# Altium schematic sheet Sheet1.SchDoc
size A4
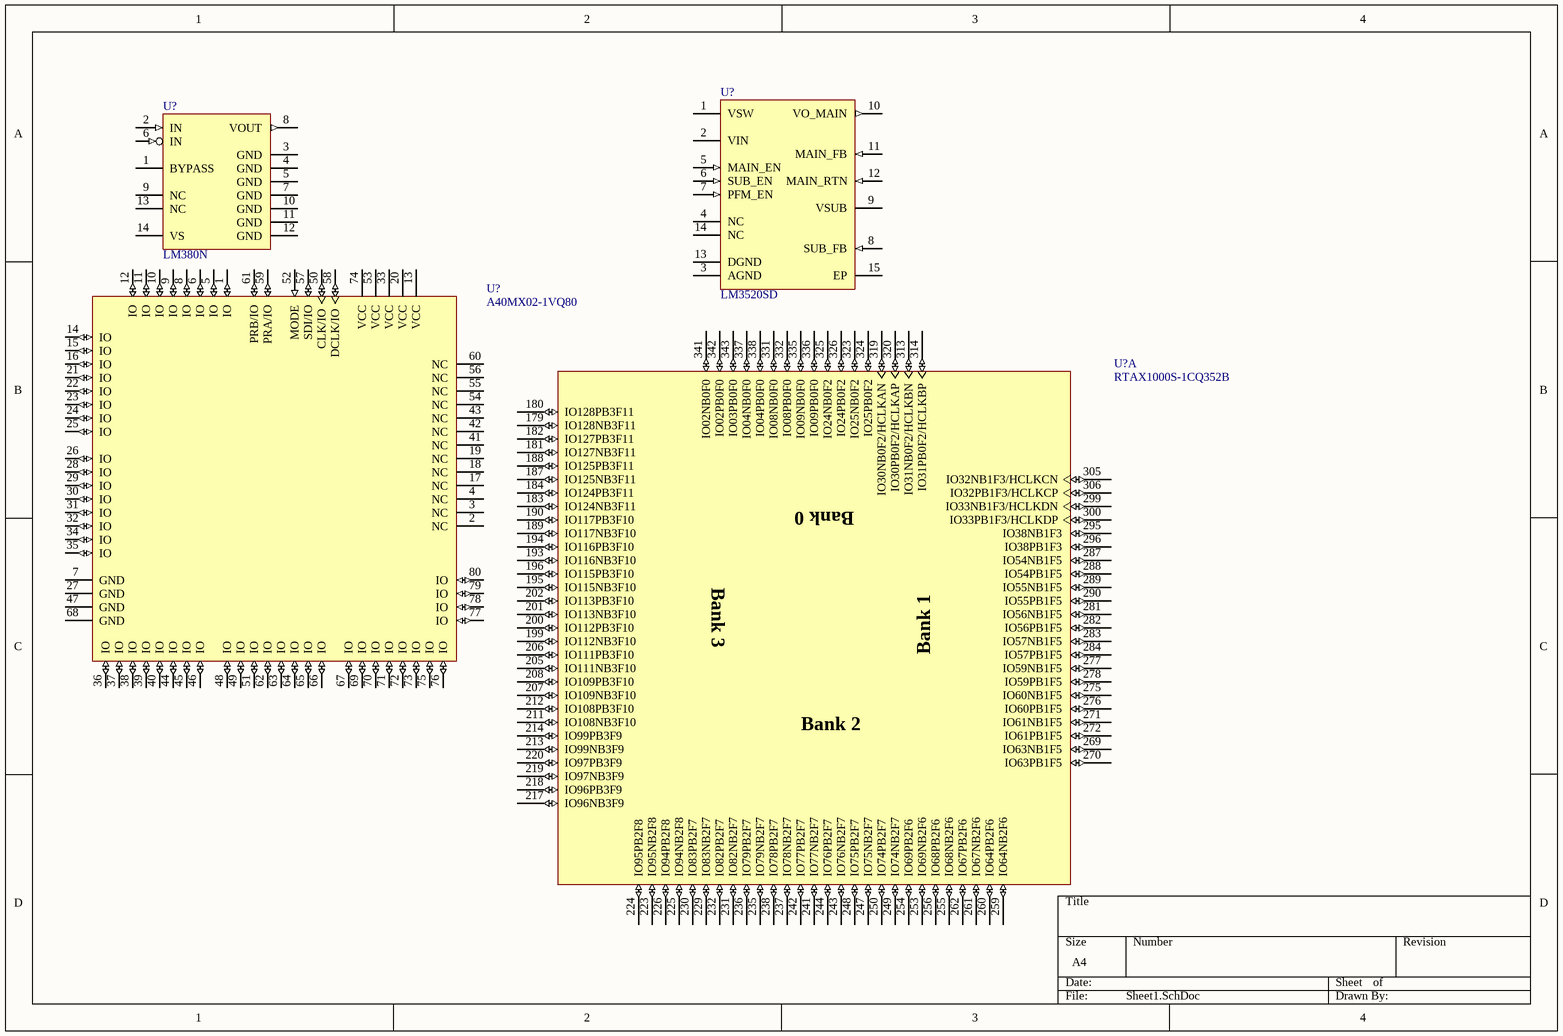
[diagram p0: Sheet1.SchDoc]

## Parts
(Parts that share a designator on the sheet are numbered #1, #2 ... from top to bottom, then left to right.)
U?#1  LM3520SD  [SDA14A]
U?#2  LM380N  [N14A]
U?#3  A40MX02-1VQ80  [VQ80_N]
U?#4  RTAX1000S-1CQ352B  [CQ352_N]  (part A of 5)

## Nets

Not connected (* = marked no-connect by the designer): U?#1 1(VSW) 2(VIN) 3(AGND) 4(NC) 5(MAIN_EN) 6(SUB_EN) 7(PFM_EN) 8(SUB_FB) 9(VSUB) 10(VO_MAIN) 11(MAIN_FB) 12(MAIN_RTN) 13(DGND) 14(NC) 15(EP); U?#2 1(BYPASS) 2(IN) 3(GND) 4(GND) 5(GND) 6(IN) 7(GND) 8(VOUT) 9(NC) 10(GND) 11(GND) 12(GND) 13(NC) 14(VS); U?#3 1(IO) 2(NC) 3(NC) 4(NC) 5(IO) 6(IO) 7(GND) 8(IO) 9(IO) 10(IO) 11(IO) 12(IO) 13(VCC) 14(IO) 15(IO) 16(IO) 17(NC) 18(NC) 19(NC) 20(VCC) 21(IO) 22(IO) 23(IO) 24(IO) 25(IO) 26(IO) 27(GND) 28(IO) 29(IO) 30(IO) 31(IO) 32(IO) 33(VCC) 34(IO) 35(IO) 36(IO) 37(IO) 38(IO) 39(IO) 40(IO) 41(NC) 42(NC) 43(NC) 44(IO) 45(IO) 46(IO) 47(GND) 48(IO) 49(IO) 50(CLK/IO) 51(IO) 52(MODE) 53(VCC) 54(NC) 55(NC) 56(NC) 57(SDI/IO) 58(DCLK/IO) 59(PRA/IO) 60(NC) 61(PRB/IO) 62(IO) 63(IO) 64(IO) 65(IO) 66(IO) 67(IO) 68(GND) 69(IO) 70(IO) 71(IO) 72(IO) 73(IO) 74(VCC) 75(IO) 76(IO) 77(IO) 78(IO) 79(IO) 80(IO); U?#4 179(IO128NB3F11) 180(IO128PB3F11) 181(IO127NB3F11) 182(IO127PB3F11) 183(IO124NB3F11) 184(IO124PB3F11) 187(IO125NB3F11) 188(IO125PB3F11) 189(IO117NB3F10) 190(IO117PB3F10) 193(IO116NB3F10) 194(IO116PB3F10) 195(IO115NB3F10) 196(IO115PB3F10) 199(IO112NB3F10) 200(IO112PB3F10) 201(IO113NB3F10) 202(IO113PB3F10) 205(IO111NB3F10) 206(IO111PB3F10) 207(IO109NB3F10) 208(IO109PB3F10) 211(IO108NB3F10) 212(IO108PB3F10) 213(IO99NB3F9) 214(IO99PB3F9) 217(IO96NB3F9) 218(IO96PB3F9) 219(IO97NB3F9) 220(IO97PB3F9) 223(IO95NB2F8) 224(IO95PB2F8) 225(IO94NB2F8) 226(IO94PB2F8) 229(IO83NB2F7) 230(IO83PB2F7) 231(IO82NB2F7) 232(IO82PB2F7) 235(IO79NB2F7) 236(IO79PB2F7) 237(IO78NB2F7) 238(IO78PB2F7) 241(IO77NB2F7) 242(IO77PB2F7) 243(IO76NB2F7) 244(IO76PB2F7) 247(IO75NB2F7) 248(IO75PB2F7) 249(IO74NB2F7) 250(IO74PB2F7) 253(IO69NB2F6) 254(IO69PB2F6) 255(IO68NB2F6) 256(IO68PB2F6) 259(IO64NB2F6) 260(IO64PB2F6) 261(IO67NB2F6) 262(IO67PB2F6) 269(IO63NB1F5) 270(IO63PB1F5) 271(IO61NB1F5) 272(IO61PB1F5) 275(IO60NB1F5) 276(IO60PB1F5) 277(IO59NB1F5) 278(IO59PB1F5) 281(IO56NB1F5) 282(IO56PB1F5) 283(IO57NB1F5) 284(IO57PB1F5) 287(IO54NB1F5) 288(IO54PB1F5) 289(IO55NB1F5) 290(IO55PB1F5) 295(IO38NB1F3) 296(IO38PB1F3) 299(IO33NB1F3/HCLKDN) 300(IO33PB1F3/HCLKDP) 305(IO32NB1F3/HCLKCN) 306(IO32PB1F3/HCLKCP) 313(IO31NB0F2/HCLKBN) 314(IO31PB0F2/HCLKBP) 319(IO30NB0F2/HCLKAN) 320(IO30PB0F2/HCLKAP) 323(IO25NB0F2) 324(IO25PB0F2) 325(IO24NB0F2) 326(IO24PB0F2) 331(IO08NB0F0) 332(IO08PB0F0) 335(IO09NB0F0) 336(IO09PB0F0) 337(IO04NB0F0) 338(IO04PB0F0) 341(IO02NB0F0) 342(IO02PB0F0) 343(IO03PB0F0)

## Notes on the sheet
- (in symbol RTAX1000S-1CQ352B, part A) Bank 0; Bank 3; Bank 1; Bank 2

## Library data of the parts
U?#1 = LM3520SD: Integrated White LED Driver with Organic LED Display Power Supply, 14-pin LLP; Manufacturer: National Semiconductor; PackageTopMarking: ZXYTT*L133B; CompType: MiscPower; Published: 4-Dec-2008; DatasheetVersion: Sep-2005; PackageVersion: revA, Jun-2003; PackageReference: SDA14A; Publisher: Altium Limited; PackageDescription: LLP, Plastic, Dual, 4 x 3 x 0.8mm Body, 14 Lead, 0.5mm Pitch, No Pullback; Supplier 1: Farnell; Supplier Part Number 1: 1312718; PartNumber: LM3520SD; RoHS: Y; PinCount: 14; ComponentLink1Description: LM3520 Datasheet; ComponentLink1URL: http://www.national.com/ds/LM/LM3520.pdf; ComponentLink2Description: LM3520 Web Page; ComponentLink2URL: http://www.national.com/pf/LM/LM3520.html; ComponentLink3Description: SDA14A Package Page; ComponentLink3URL: http://www.national.com/packaging/folders/sda14a.html
U?#2 = LM380N: 2.5W Audio Power Amplifier, 14-pin MDIP; Manufacturer: National Semiconductor; PackageTopMarking: NSUZXYYTTE#*LM380N; PowerWise: N; CompType: Audio IC; Published: 4-Dec-2008; DatasheetVersion: Aug-2000; PackageVersion: revG, May-2006; PackageReference: N14A; Publisher: Altium Limited; PackageDescription: MDIP, .750 x .250 x.130in, 14 Lead, .100in Pitch; Supplier 1: Farnell; Supplier Part Number 1: 9488308; PartNumber: LM380N; RoHS: N; PinCount: 14; Code_JEDEC: MS-001-AA; ComponentLink1Description: LM380 Datasheet; ComponentLink1URL: http://www.national.com/ds/LM/LM380.pdf; ComponentLink2Description: LM380 Web Page; ComponentLink2URL: http://www.national.com/pf/LM/LM380.html; ComponentLink3Description: N14A Package Page; ComponentLink3URL: http://www.national.com/packaging/folders/n14a.html
U?#3 = A40MX02-1VQ80: A40MX02 FPGA, 57 User IOs, 80-Pin VQFP, Speed Grade 1, Commercial Grade; Published: 21-May-2003; LatestRevisionDate: 11-Dec-2009; LatestRevisionNote: Updated to datasheet version 6.1 Apr-2009.; DatasheetVersion: v6.1, Apr-2009; PackageVersion: ver11.2, Nov-2009; PackageReference: VQ80; Publisher: Altium Limited; PackageDescription: 80-Pin Plastic Quad Flat Pack (VQ80); Code_JEDEC: MS-026-AEC; ComponentLink1Description: MX Datasheet; ComponentLink1URL: http://www.actel.com/documents/MX_DS.pdf; ComponentLink2Description: Package Mechanical Drawings; ComponentLink2URL: http://www.actel.com/documents/PckgMechDrwngs.pdf; ComponentLink3Description: MX Documents; ComponentLink3URL: http://www.actel.com/products/mx/docs.aspx; ComponentLink4Description: Actel.com Home; ComponentLink4URL: http://www.actel.com/
U?#4 = RTAX1000S-1CQ352B: RTAX-S RadTolerant FPGA, 1 Million Equivalent System Gates, 352-Pin CQFP, Speed Grade 1, MIL-STD-883 Class B; Published: 11-Dec-2009; DatasheetVersion: v5.4, May-2009; PackageVersion: ver11.2, Nov-2009; PackageReference: CQ352; Publisher: Altium Limited; PackageDescription: 352-Pin Ceramic Quad Flat Pack (CQFP), Cavity Up without Heat Sink; Code_JEDEC: MO-134-AE; ComponentLink1Description: RTAX-S/SL RadTolerant Datasheet; ComponentLink1URL: http://www.actel.com/documents/RTAXS_DS.pdf; ComponentLink2Description: Package Mechanical Drawings; ComponentLink2URL: http://www.actel.com/documents/PckgMechDrwngs.pdf; ComponentLink3Description: RTAX-S/SL RadTolerant Documents; ComponentLink3URL: http://www.actel.com/products/milaero/rtaxs/docs.aspx; ComponentLink4Description: Actel.com Home; ComponentLink4URL: http://www.actel.com/